# EAGLE design power_breakout (EAGLE 9.5.1)
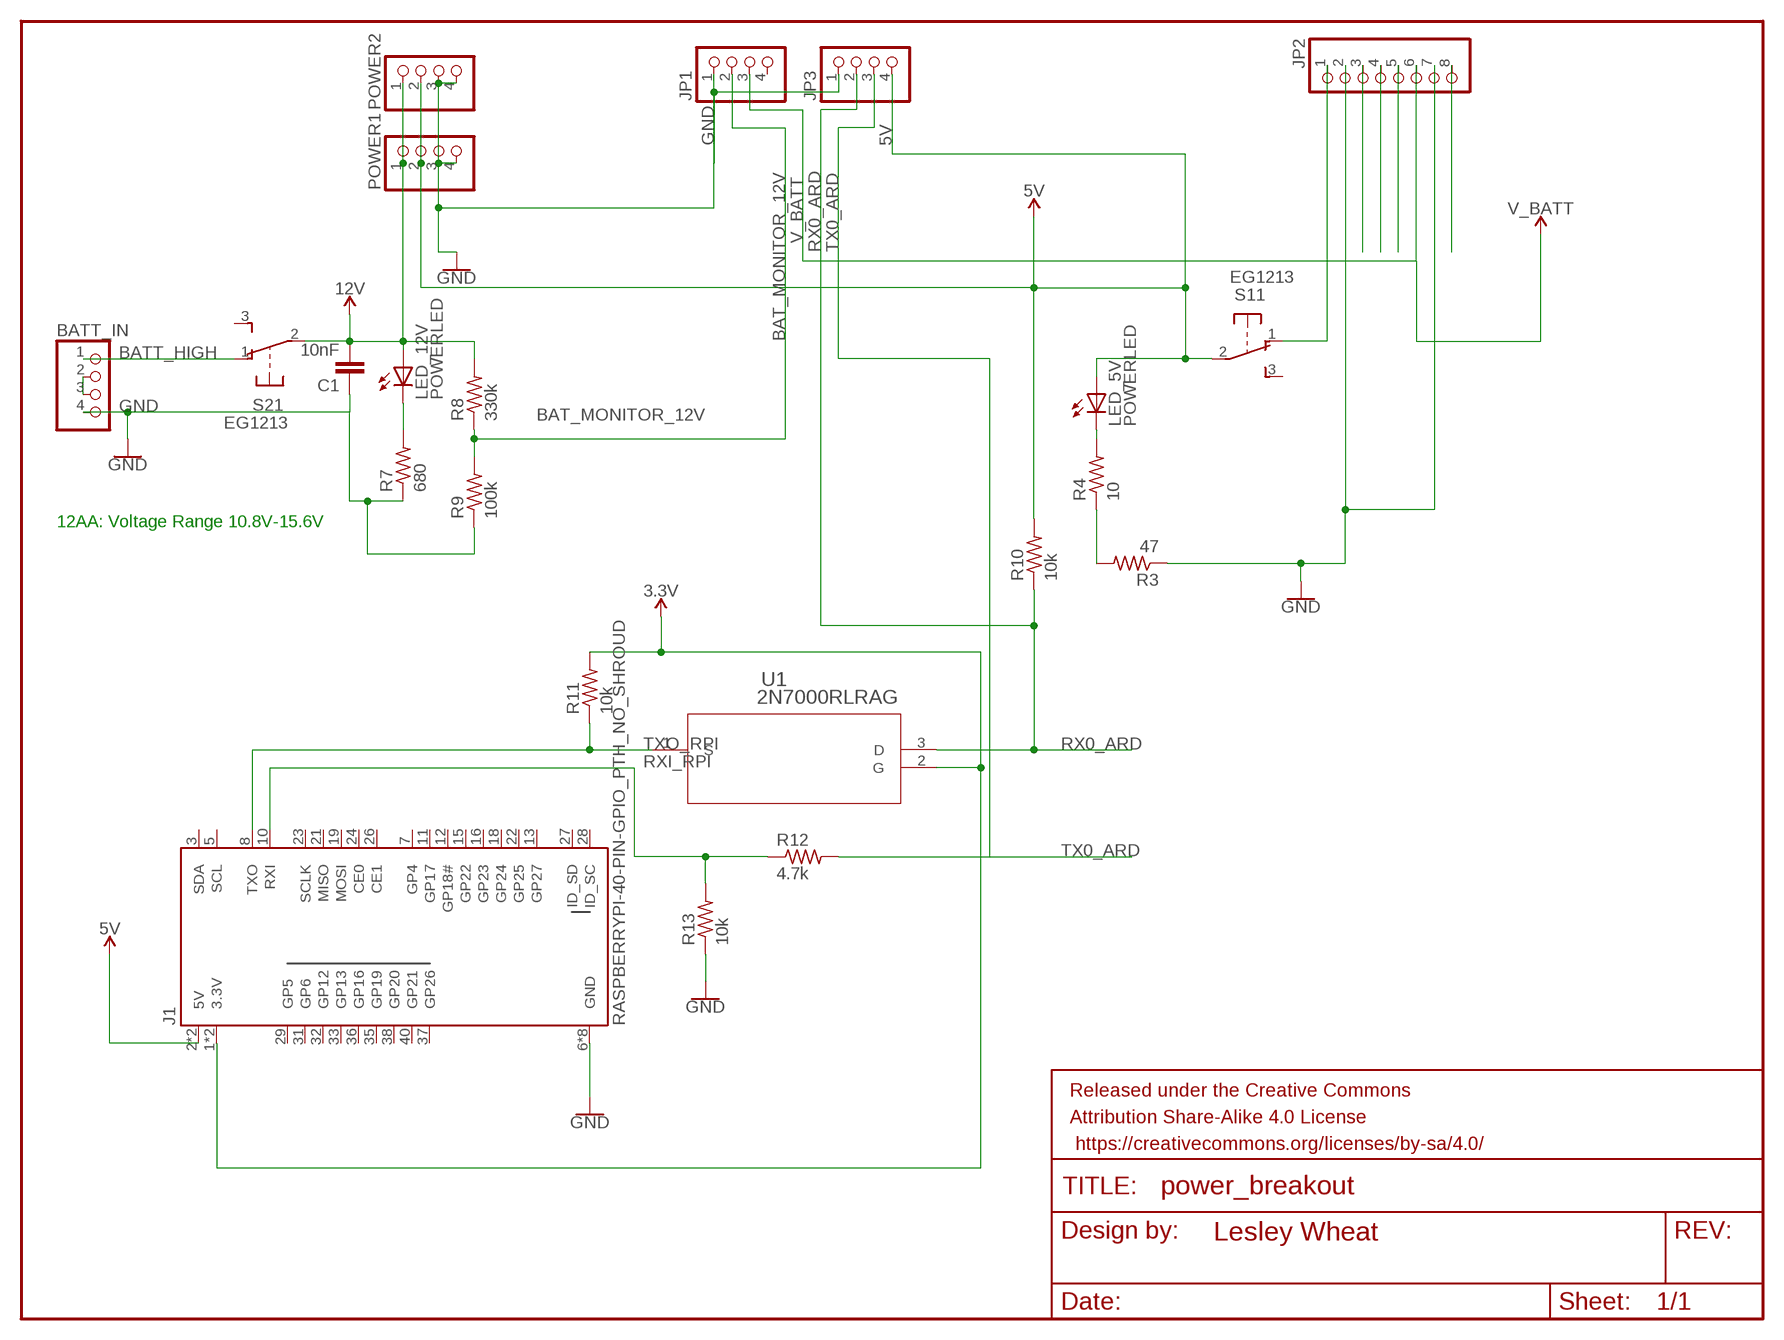
[diagram p0: schematic, sheet 1]

## Parts
BATT_IN  PINHD-1X4  [1X04]
C1  10nF  10NF-PTH-10MM-10000V-1-%  [CAP-PTH-10MM]
FRAME1  FRAME-LETTERNO_PACKAGE  [DUMMY]
J1  RASPBERRYPI-40-PIN-GPIO_PTH_NO_SHROUD  [2X20]
JP1  PINHD-1X4  [1X04]
JP2  PINHD-1X8  [1X08]
JP3  PINHD-1X4  [1X04]
LED_5V  POWERLED  LED5MM  [LED5MM]
LED_12V  POWERLED  LED5MM  [LED5MM]
POWER1  PINHD-1X4  [1X04]
POWER2  PINHD-1X4  [1X04]
R3  47  R-US_0207/12  [0207/12]
R4  10  R-US_0207/12  [0207/12]
R7  680  R-US_0207/12  [0207/12]
R8  330k  R-US_0207/12  [0207/12]
R9  100k  R-US_0207/12  [0207/12]
R10  10k  R-US_0207/12  [0207/12]
R11  10k  R-US_0207/12  [0207/12]
R12  4.7k  R-US_0207/12  [0207/12]
R13  10k  R-US_0207/12  [0207/12]
S1  EG1213  [EG1213]
S2  EG1213  [EG1213]
U1  2N7000RLRAG  [TO-92]

## Nets
3.3V: J1.1(3.3V) J1.17(3.3V) R11.2 U1.2(G)
5V: J1.2(5V) J1.4(5V) JP3.4 LED_5V.A POWER1.2 POWER2.2 R10.2 S1.2(1:P)
12V: C1.2 LED_12V.A POWER1.1 POWER2.1 R8.2 S2.2(1:P)
BAT_MONITOR_12V: JP1.2 R8.1 R9.2
BATT_HIGH: BATT_IN.1 S2.1(1:O)
GND: BATT_IN.4 C1.1 J1.6(GND) J1.9(GND) J1.14(GND) J1.20(GND) J1.25(GND) J1.30(GND) J1.34(GND) J1.39(GND) JP1.1 JP2.2 JP2.7 JP3.1 POWER1.3 POWER1.4 POWER2.3 POWER2.4 R3.1 R7.1 R9.1 R13.1
N$1: BATT_IN.2 BATT_IN.3
N$2: LED_12V.K(C) R7.2
N$4: JP2.3
N$5: JP2.4
N$6: JP2.5
N$7: JP2.8
N$30: JP2.1 S1.1(1:O)
N$96: LED_5V.K(C) R4.2
N$97: R3.2 R4.1
RX0_ARD: JP3.2 R10.1 U1.3(D)
RXI_RPI: J1.10(RXI) R12.1 R13.2
TX0_ARD: JP3.3 R12.2
TXO_RPI: J1.8(TXO) R11.1 U1.1(S)
V_BATT: JP1.3 JP2.6
Unconnected: J1.3(SDA) J1.5(SCL) J1.7(GP4) J1.11(GP17) J1.12(GP18#) J1.13(GP27) J1.15(GP22) J1.16(GP23) J1.18(GP24) J1.19(MOSI) J1.21(MISO) J1.22(GP25) J1.23(SCLK) J1.24(CE0) J1.26(CE1) J1.27(ID_SD) J1.28(ID_SC) J1.29(GP5) J1.31(GP6) J1.32(GP12) J1.33(GP13) J1.35(GP19) J1.36(GP16) J1.37(GP26) J1.38(GP20) J1.40(GP21) JP1.4 S1.3(1:S) S1.MT1(MT) S1.MT2(MT) S2.3(1:S) S2.MT1(MT) S2.MT2(MT)

## Notes on the sheet
- 12AA: Voltage Range 10.8V-15.6V

## Library data of the parts
BATT_IN JP1 JP3 POWER1 POWER2 = pinhead:PINHD-1X4: PIN HEADER
C1 = SparkFun-Capacitors:10NF: 0.01uF/10nF/10,000pF ceramic capacitors A capacitor is a passive two-terminal electrical component used to store electrical energy temporarily in an electric field. CAP-09321; PROD_ID: CAP-09321
FRAME1 = SparkFun-Aesthetics:FRAME-LETTER: Schematic Frame - Letter Standard 8.5x11 US Letter frame; DESIGNER: Lesley Wheat; VERSION: v01
J1 = SparkFun-Connectors:RASPBERRYPI-40-PIN-GPIO: Raspberry Pi GPIO Header 2x20 pin connector, as found on B, B+, A+ models. Both shrouded PTH and SMT versions available. SparkFun Products: GPIO Shrouded Header <https://www.sparkfun.com/products/13054>- PTH SparkFun Pi Wedge (Preassembled) <https://www.sparkfun.com/products/13717>
JP2 = pinhead:PINHD-1X8: PIN HEADER
LED_5V LED_12V = led:LED: LED OSRAM: - CHIPLED LG R971, LG N971, LY N971, LG Q971, LY Q971, LO R971, LY R971 LH N974, LH R974 LS Q976, LO Q976, LY Q976 LO Q996 - Hyper CHIPLED LW Q18S LB Q993, LB Q99A, LB R99A - SideLED LS A670, LO A670, LY A670, LG A670, LP A670 LB A673, LV A673, LT A673, LW A673 LH A674 LY A675 LS A676, LA A676, LO A676, LY A676, LW A676 LS A679, LY A679, LG A679 - Hyper Micro SIDELED® LS Y876, LA Y876, LO Y876, LY Y876 LT Y87S - SmartLED LW L88C, LW L88S LB L89C, LB L89S, LG L890 LS L89K, LO L89K, LY L89K LS L896, LA L896, LO L896, LY L896 - TOPLED LS T670, LO T670, LY T670, LG T670, LP T670 LSG T670, LSP T670, LSY T670, LOP T670, LYG T670 LG T671, LOG T671, LSG T671 LB T673, LV T673, LT T673, LW T673 LH T674 LS T676, LA T676, LO T676, LY T676, LB T676, LH T676, LSB T676, LW T676 LB T67C, LV T67C, LT T67C, LS T67K, LO T67K, LY T67K, LW E67C LS E67B, LA E67B, LO E67B, LY E67B, LB E67C, LV E67C, LT E67C LW T67C LS T679, LY T679, LG T679 LS T770, LO T770, LY T770, LG T770, LP T770 LB T773, LV T773, LT T773, LW T773 LH T774 LS E675, LA E675, LY E675, LS T675 LS T776, LA T776, LO T776, LY T776, LB T776 LHGB T686 LT T68C, LB T68C - Hyper Mini TOPLED® LB M676 - Mini TOPLED Santana® LG M470 LS M47K, LO M47K, LY M47K Source: http://www.osram.convergy.de LUXEON: - LUMILED® LXK2-PW12-R00, LXK2-PW12-S00, LXK2-PW14-U00, LXK2-PW14-V00 LXK2-PM12-R00, LXK2-PM12-S00, LXK2-PM14-U00 LXK2-PE12-Q00, LXK2-PE12-R00, LXK2-PE12-S00, LXK2-PE14-T00, LXK2-PE14-U00 LXK2-PB12-K00, LXK2-PB12-L00, LXK2-PB12-M00, LXK2-PB14-N00, LXK2-PB14-P00, LXK2-PB14-Q00 LXK2-PR12-L00, LXK2-PR12-M00, LXK2-PR14-Q00, LXK2-PR14-R00 LXK2-PD12-Q00, LXK2-PD12-R00, LXK2-PD12-S00 LXK2-PH12-R00, LXK2-PH12-S00 LXK2-PL12-P00, LXK2-PL12-Q00, LXK2-PL12-R00 Source: www.luxeon.com KINGBRIGHT: KA-3528ASYC Source: www.kingbright.com
R3 R4 R7-R13 = resistor:R-US_: RESISTOR, American symbol
S1 S2 = adafruit:EG1213: E-Switch right-angle slide SPDT Part #EG1213 http://www.ladyada.net/library/eagle
U1 = 2N7000RLRAG:2N7000RLRAG; BUILT_BY: EMA_UL_Team; MANUFACTURER_PART_NUMBER: 2N7000RLRAG; VENDOR: ON Semiconductor

## Board
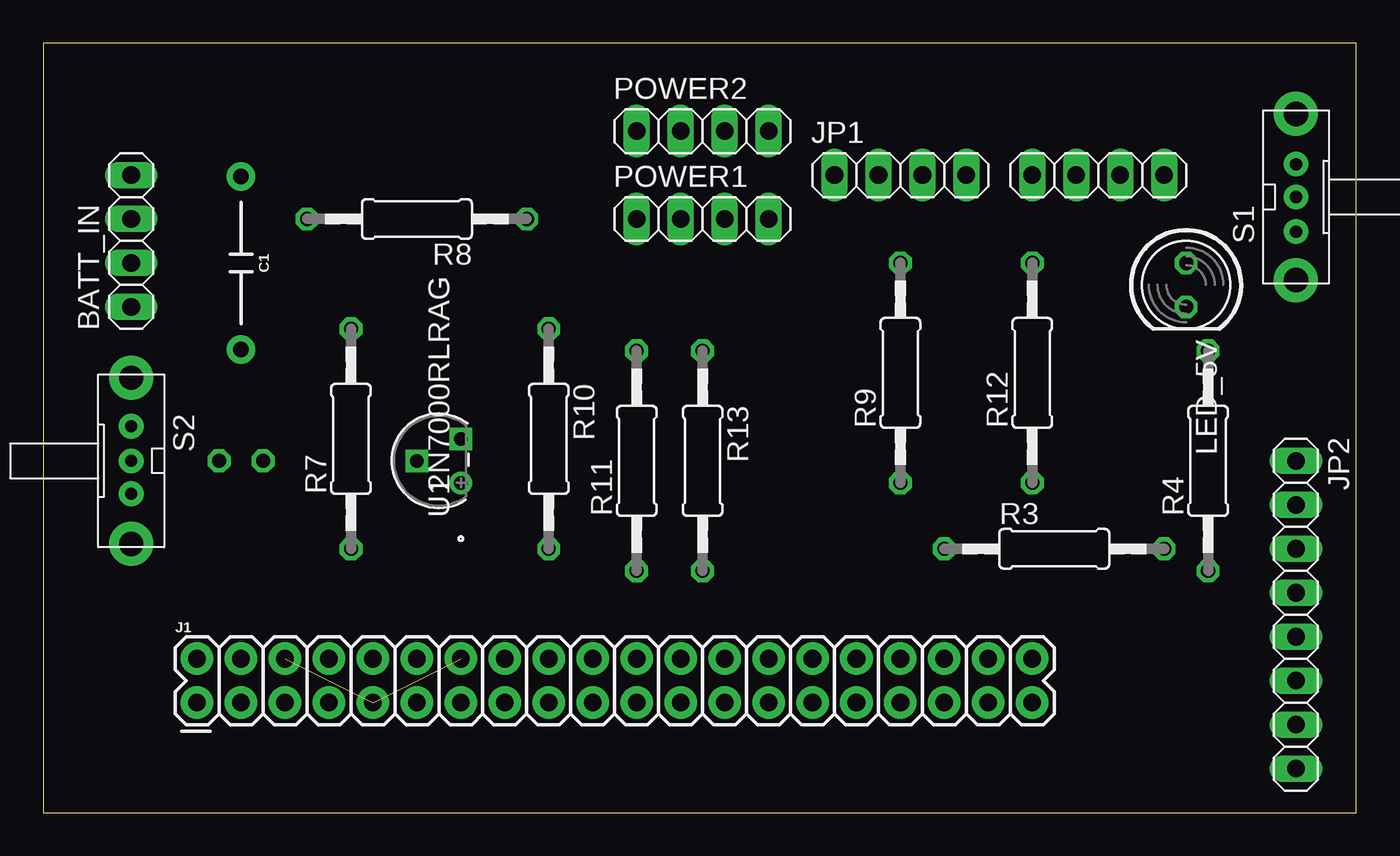
[diagram p1: board, top side]
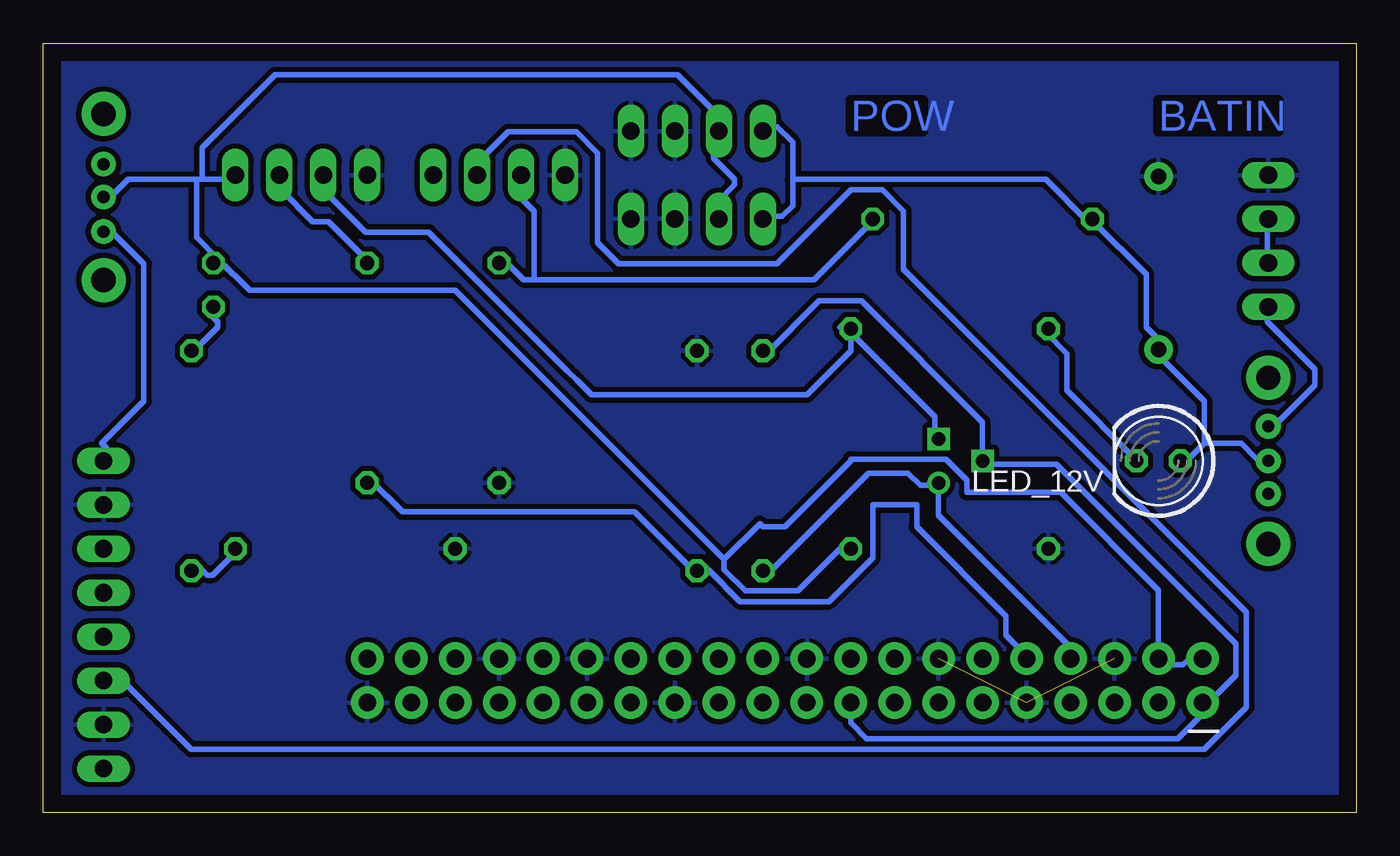
[diagram p2: board, bottom side, seen from below]

Size 75.87 x 44.44 mm. Coordinates in mm from the lower left corner, seen from the top.
Outline: 0,0 75.87,0 75.87,44.44 0,44.44 0,0
Copper layers (1*16): Top 0.035mm / dielectric 1.5mm / Bottom 0.035mm
Design rules "default *": minimum track width 12mil, minimum drill 20mil, track to track 12mil, track to pad 12mil, pad to pad 12mil, via to via 12mil, smd to smd 12mil, copper to edge 40mil, drill to drill 12mil, minimum pad ring 10mil, minimum via ring 8mil, stop-mask expansion 4mil, vias tented up to drill 0mil, thermal gap 10mil

### Footprints (pad centres in the part's own frame; a part is rotated, then mirrored left to right if it is on the bottom)
1X04 = drill 1.016 long: 1 -3.81,0; 2 -1.27,0; 3 1.27,0; 4 3.81,0
CAP-PTH-10MM = drill 0.9 pad 1.651: 1 -5,0; 2 5,0
2X20 = drill 1.016 pad 1.88: 1 0,0; 2 0,2.54; 3 2.54,0; 4 2.54,2.54; 5 5.08,0; 6 5.08,2.54; 7 7.62,0; 8 7.62,2.54; 9 10.16,0; 10 10.16,2.54; 11 12.7,0; 12 12.7,2.54; 13 15.24,0; 14 15.24,2.54; 15 17.78,0; 16 17.78,2.54; 17 20.32,0; 18 20.32,2.54; 19 22.86,0; 20 22.86,2.54; 21 25.4,0; 22 25.4,2.54; 23 27.94,0; 24 27.94,2.54; 25 30.48,0; 26 30.48,2.54; 27 33.02,0; 28 33.02,2.54; 29 35.56,0; 30 35.56,2.54; 31 38.1,0; 32 38.1,2.54; 33 40.64,0; 34 40.64,2.54; 35 43.18,0; 36 43.18,2.54; 37 45.72,0; 38 45.72,2.54; 39 48.26,0; 40 48.26,2.54
1X08 = drill 1.016 long: 1 -8.89,0; 2 -6.35,0; 3 -3.81,0; 4 -1.27,0; 5 1.27,0; 6 3.81,0; 7 6.35,0; 8 8.89,0
LED5MM = drill 0.813 octagon: A -1.27,0; K 1.27,0
0207/12 = drill 0.813 octagon: 1 -6.35,0; 2 6.35,0
EG1213 = drill 0.7 pad 1.422: 1 -2,0; 2 0,0; 3 1.9,0 | drill 1.4 pad 2.54: MT1 -4.8,0; MT2 4.8,0
TO-92 = drill 0.787 pad 1.295: 1 -2.54,-2.54 | drill 0.787 pad 1.295 square: 2 -1.27,0; 3 0,-2.54

### Placement (x,y rotation side)
BATT_IN  5.08,33.02 90 top
C1  11.43,31.75 270 top
FRAME1  -50.8,73.66 0 top  (outside the outline)
J1  8.89,6.35 0 top
JP1  49.53,36.83 0 top
JP2  72.39,11.43 270 top
JP3  60.96,36.83 0 top
LED_5V  66.04,30.48 270 top
LED_12V  11.43,20.32 180 bottom
POWER1  38.1,34.29 0 top
POWER2  38.1,39.37 0 top
R3  58.42,15.24 0 top
R4  67.31,20.32 90 top
R7  17.78,21.59 90 top
R8  21.59,34.29 180 top
R9  49.53,25.4 90 top
R10  29.21,21.59 270 top
R11  34.29,20.32 90 top
R12  57.15,25.4 90 top
R13  38.1,20.32 270 top
S1  72.39,35.56 90 top
S2  5.08,20.32 270 top
U1  21.59,21.59 90 top

### Tracks (layer width: path | path; a pad name or v marks a point on that pad's centre or on a via)
3.3V
  Bottom 0.305: R11.2 34.09,26.52 31.04,29.57 28.6,29.57 21.59,22.55 U1.2 21.59,20.12 17.32,20.12 6.96,9.75 6.96,7.92 8.48,6.4 8.79,6.4 J1.1 9.09,6.1 9.09,5.49 10.31,4.27 28.3,4.27 29.21,5.18 J1.17
5V
  Bottom 0.305: POWER1.2 36.83,35.36 35.92,36.27 35.92,36.58 37.14,37.8 37.14,39.01 36.83,39.32 POWER2.2 36.83,40.23 39.22,42.62 62.48,42.62 66.7,38.41 66.7,36.58 | 66.7,36.58 64.87,36.58 JP3.4 | 66.7,36.58 67.01,36.58 | S1.2 72.19,35.66 71.88,35.66 70.97,36.58 67.01,36.58 | J1.2 9.09,8.84 9.7,8.84 10.01,8.53 10.92,8.53 11.23,8.84 J1.4 11.43,12.85 17.07,18.49 22.5,18.49 22.5,19.2 23.72,20.42 29.21,20.42 29.21,20.32 33.02,16.51 34.29,16.51 34.47,16.69 36.53,14.63 | R10.2 29.82,15.24 32.26,12.8 35.31,12.8 36.53,14.02 36.53,14.63 | 36.53,14.63 52.07,30.18 63.96,30.18 65.79,32 | 67.01,36.58 67.01,33.22 65.79,32 | 65.79,32 LED_5V.A
12V
  Bottom 0.305: 32.56,36.58 32.56,38.71 33.48,39.62 34.09,39.62 POWER2.1 | 32.56,36.58 32.56,35.05 33.17,34.44 34.09,34.44 POWER1.1 | 8.79,21.34 9.7,20.42 10.01,20.42 LED_12V.A | 8.79,21.34 6.66,21.34 5.74,20.42 5.13,20.42 S2.2 | 8.79,21.34 8.79,23.77 11.53,26.52 C1.2 11.53,26.82 11.53,27.43 12.14,28.04 12.14,31.09 15.19,34.14 R8.2 15.49,34.14 17.93,36.58 32.56,36.58
BAT_MONITOR_12V
  Bottom 0.305: 47.5,30.79 48.11,30.79 49.33,32 R9.2 | 47.5,30.79 31.34,30.79 27.99,34.14 R8.1 | 47.5,30.79 47.5,34.75 48.11,35.36 48.11,36.58 JP1.2
BATT_HIGH
  Bottom 0.305: S2.1 4.83,22.55 4.52,22.55 2.39,24.69 2.39,25.6 5.13,28.35 5.13,28.96 BATT_IN.1
GND  (2 unrouted)
  pour Bottom: 74.93,44.45 74.93,0 0,0 0,44.45
N$1
  Bottom 0.305: BATT_IN.2 5.13,32 5.13,34.14 BATT_IN.3
N$2
  Bottom 0.305: LED_12V.K 12.75,20.42 16.71,24.38 16.71,26.52 17.93,27.74 R7.2
N$30
  Bottom 0.305: S1.1 72.19,33.53 71.88,33.53 70.05,31.7 70.05,23.77 72.49,21.34 72.19,21.03 72.19,20.42 JP2.1 72.49,20.42
N$96
  Bottom 0.305: R4.2 67.31,26.82 67.01,26.82 65.79,28.04 65.79,28.35 66.4,28.96 66.09,29.26 LED_5V.K
N$97
  Bottom 0.305: R3.2 64.87,15.24 64.87,14.94 66.09,13.72 66.4,13.72 66.7,14.02 67.31,14.02 R4.1
RX0_ARD
  Bottom 0.305: 29.21,28.04 28.9,27.74 28.9,27.43 24.33,22.86 24.33,21.64 U1.3 | JP3.2 59.69,35.97 57.25,33.53 53.59,33.53 45.59,25.53 45.06,24.99 44.2,24.13 31.75,24.13 29.21,26.67 R10.1 29.21,28.04 | 29.21,28.04 29.82,28.04
RXI_RPI
  Bottom 0.305: R12.1 56.95,19.2 55.12,17.37 41.71,17.37 38.35,14.02 R13.2 38.05,14.02 37.44,14.02 35.61,12.19 30.48,12.19 27.94,14.73 27.94,17.78 25.4,17.78 25.4,16.51 20.24,11.35 20.24,10.24 19.15,9.14 J1.10
TX0_ARD
  Bottom 0.305: R12.2 57.25,32 59.39,34.14 60.3,34.14 62.13,35.97 62.13,36.58 JP3.3
TXO_RPI
  Bottom 0.305: R11.1 34.09,13.72 28.19,19.61 25.91,19.61 25.2,18.9 24.33,18.9 U1.1 24.13,17.17 16.71,9.75 16.71,9.14 J1.8
V_BATT
  Bottom 0.305: 72.49,7.62 JP2.6 71.27,7.62 67.31,3.66 8.79,3.66 6.35,6.1 6.35,11.58 26.16,31.39 26.16,34.75 27.38,35.97 29.21,35.97 33.48,31.7 42.62,31.7 43.84,32.92 43.84,38.1 45.06,39.32 49.02,39.32 50.55,37.8 50.55,36.88 JP1.3

### Text on the board
Bottom: BATIN | POW